# Altium schematic sheet MainAssembly.SchDoc
size 292 x 193 mm; CheckedBy: Jakub Howors; Author: Łukasz Gójski; CompanyName: Politechnika Warszawska; Organization: EITI; Address1: Nowowiejska 15/19; Address2: 00-665 Warszawa; SheetNumber: 1; SheetTotal: 13; HTTPLink: www.pw.edu.pl
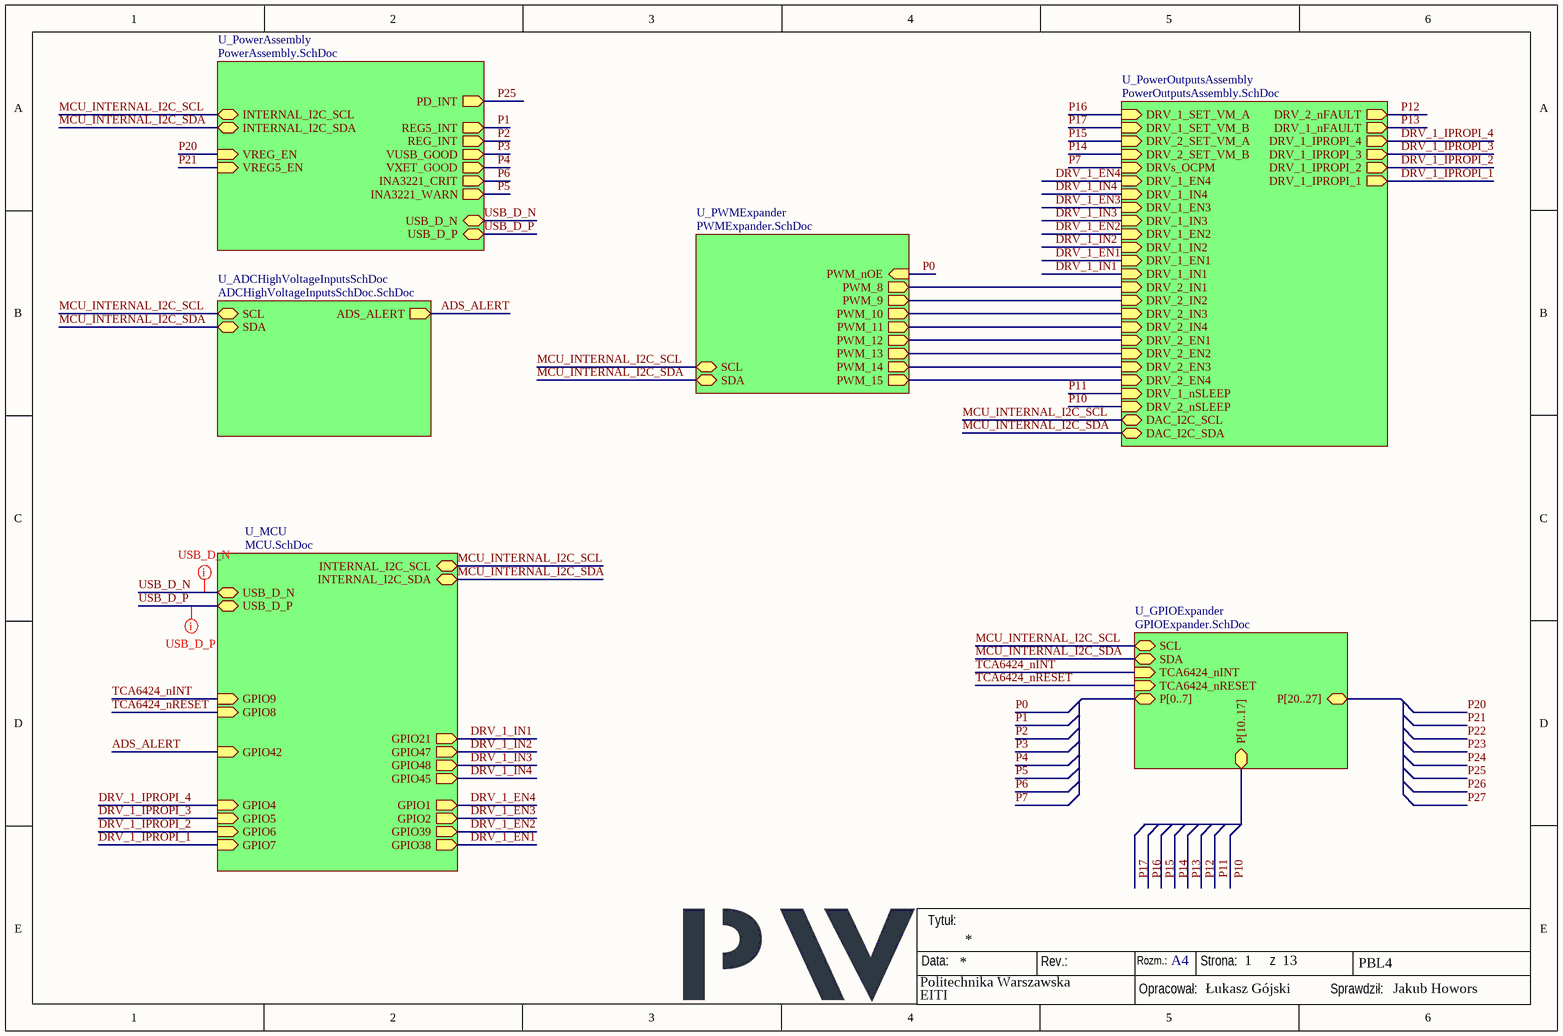
[diagram p0: MainAssembly.SchDoc]

## Sub-sheets
U_ADCHighVoltageInputsSchDoc = ADCHighVoltageInputsSchDoc.SchDoc: ADS_ALERT (out), SCL (bidir), SDA (bidir)
U_GPIOExpander = GPIOExpander.SchDoc: TCA6424_nINT (in), TCA6424_nRESET (in), P[0..7] (bidir), P[10..17] (bidir), P[20..27] (bidir), SCL (bidir), SDA (bidir)
U_MCU = MCU.SchDoc: INTERNAL_I2C_SCL (bidir), INTERNAL_I2C_SDA (bidir), GPIO2 (out), GPIO4 (in), GPIO5 (in), GPIO6 (in), GPIO7 (in), GPIO8 (in), GPIO21 (out), GPIO38 (out), GPIO47 (out), GPIO48 (out), GPIO45 (out), GPIO39 (out), USB_D_N (bidir), USB_D_P (bidir), GPIO1 (out), GPIO42 (in), GPIO9 (in)
U_PowerAssembly = PowerAssembly.SchDoc: REG5_INT (out), REG_INT (out), VUSB_GOOD (out), VXET_GOOD (out), INA3221_CRIT (out), INA3221_WARN (out), INTERNAL_I2C_SDA (bidir), INTERNAL_I2C_SCL (bidir), VREG_EN (in), VREG5_EN (in), USB_D_N (bidir), USB_D_P (bidir), PD_INT (out)
U_PowerOutputsAssembly = PowerOutputsAssembly.SchDoc: DRV_2_nFAULT (out), DRV_1_nFAULT (out), DRV_1_IPROPI_4 (out), DRV_1_IPROPI_3 (out), DRV_1_IPROPI_2 (out), DRV_1_IPROPI_1 (out), DRV_1_SET_VM_A (in), DRV_1_SET_VM_B (in), DRV_2_SET_VM_A (in), DRV_2_SET_VM_B (in), DRVs_OCPM (in), DRV_1_EN4 (in), DRV_1_IN4 (in), DRV_1_EN3 (in), DRV_1_IN3 (in), DRV_1_EN2 (in), DRV_1_IN2 (in), DRV_1_EN1 (in), DRV_1_IN1 (in), DRV_2_EN4 (in), DRV_2_IN4 (in), DRV_2_EN3 (in), DRV_2_IN3 (in), DRV_2_EN2 (in), DRV_2_IN2 (in), DRV_2_EN1 (in), DRV_2_IN1 (in), DRV_1_nSLEEP (in), DRV_2_nSLEEP (in), DAC_I2C_SCL (bidir), DAC_I2C_SDA (bidir)
U_PWMExpander = PWMExpander.SchDoc: SDA (bidir), SCL (bidir), PWM_nOE (in), PWM_8 (out), PWM_9 (out), PWM_10 (out), PWM_11 (out), PWM_12 (out), PWM_13 (out), PWM_14 (out), PWM_15 (out)

## Nets
ADS_ALERT: sheet U_MCU/GPIO42, sheet U_ADCHighVoltageInputsSchDoc/ADS_ALERT
DRV_1_EN1: sheet U_PowerOutputsAssembly/DRV_1_EN1, sheet U_MCU/GPIO38
DRV_1_EN2: sheet U_PowerOutputsAssembly/DRV_1_EN2, sheet U_MCU/GPIO39
DRV_1_EN3: sheet U_PowerOutputsAssembly/DRV_1_EN3, sheet U_MCU/GPIO2
DRV_1_EN4: sheet U_PowerOutputsAssembly/DRV_1_EN4, sheet U_MCU/GPIO1
DRV_1_IN1: sheet U_PowerOutputsAssembly/DRV_1_IN1, sheet U_MCU/GPIO21
DRV_1_IN2: sheet U_PowerOutputsAssembly/DRV_1_IN2, sheet U_MCU/GPIO47
DRV_1_IN3: sheet U_PowerOutputsAssembly/DRV_1_IN3, sheet U_MCU/GPIO48
DRV_1_IN4: sheet U_PowerOutputsAssembly/DRV_1_IN4, sheet U_MCU/GPIO45
DRV_1_IPROPI_1: sheet U_PowerOutputsAssembly/DRV_1_IPROPI_1, sheet U_MCU/GPIO7
DRV_1_IPROPI_2: sheet U_PowerOutputsAssembly/DRV_1_IPROPI_2, sheet U_MCU/GPIO6
DRV_1_IPROPI_3: sheet U_PowerOutputsAssembly/DRV_1_IPROPI_3, sheet U_MCU/GPIO5
DRV_1_IPROPI_4: sheet U_PowerOutputsAssembly/DRV_1_IPROPI_4, sheet U_MCU/GPIO4
MCU_INTERNAL_I2C_SCL: sheet U_PowerAssembly/INTERNAL_I2C_SCL, sheet U_PowerOutputsAssembly/DAC_I2C_SCL, sheet U_PWMExpander/SCL, sheet U_MCU/INTERNAL_I2C_SCL, sheet U_ADCHighVoltageInputsSchDoc/SCL, sheet U_GPIOExpander/SCL
MCU_INTERNAL_I2C_SDA: sheet U_PowerAssembly/INTERNAL_I2C_SDA, sheet U_PowerOutputsAssembly/DAC_I2C_SDA, sheet U_PWMExpander/SDA, sheet U_MCU/INTERNAL_I2C_SDA, sheet U_ADCHighVoltageInputsSchDoc/SDA, sheet U_GPIOExpander/SDA
P0: sheet U_PWMExpander/PWM_nOE
P1: sheet U_PowerAssembly/REG5_INT
P2: sheet U_PowerAssembly/REG_INT
P3: sheet U_PowerAssembly/VUSB_GOOD
P4: sheet U_PowerAssembly/VXET_GOOD
P5: sheet U_PowerAssembly/INA3221_WARN
P6: sheet U_PowerAssembly/INA3221_CRIT
P7: sheet U_PowerOutputsAssembly/DRVs_OCPM
P10: sheet U_PowerOutputsAssembly/DRV_2_nSLEEP
P11: sheet U_PowerOutputsAssembly/DRV_1_nSLEEP
P12: sheet U_PowerOutputsAssembly/DRV_2_nFAULT
P13: sheet U_PowerOutputsAssembly/DRV_1_nFAULT
P14: sheet U_PowerOutputsAssembly/DRV_2_SET_VM_B
P15: sheet U_PowerOutputsAssembly/DRV_2_SET_VM_A
P16: sheet U_PowerOutputsAssembly/DRV_1_SET_VM_A
P17: sheet U_PowerOutputsAssembly/DRV_1_SET_VM_B
P20: sheet U_PowerAssembly/VREG_EN
P21: sheet U_PowerAssembly/VREG5_EN
P25: sheet U_PowerAssembly/PD_INT
TCA6424_nINT: sheet U_MCU/GPIO9, sheet U_GPIOExpander/TCA6424_nINT
TCA6424_nRESET: sheet U_MCU/GPIO8, sheet U_GPIOExpander/TCA6424_nRESET
USB_D_N: sheet U_PowerAssembly/USB_D_N, sheet U_MCU/USB_D_N
USB_D_P: sheet U_PowerAssembly/USB_D_P, sheet U_MCU/USB_D_P
(unnamed): sheet U_PowerOutputsAssembly/DRV_2_EN4, sheet U_PWMExpander/PWM_15
(unnamed): sheet U_PowerOutputsAssembly/DRV_2_IN4, sheet U_PWMExpander/PWM_11
(unnamed): sheet U_PowerOutputsAssembly/DRV_2_EN3, sheet U_PWMExpander/PWM_14
(unnamed): sheet U_PowerOutputsAssembly/DRV_2_IN3, sheet U_PWMExpander/PWM_10
(unnamed): sheet U_PowerOutputsAssembly/DRV_2_EN2, sheet U_PWMExpander/PWM_13
(unnamed): sheet U_PowerOutputsAssembly/DRV_2_IN2, sheet U_PWMExpander/PWM_9
(unnamed): sheet U_PowerOutputsAssembly/DRV_2_EN1, sheet U_PWMExpander/PWM_12
(unnamed): sheet U_PowerOutputsAssembly/DRV_2_IN1, sheet U_PWMExpander/PWM_8

## Layout directives
differential pair: USB_D_N, USB_D_P

## Notes on the sheet
- Data:
- Tytuł:
- Rev.:
- Rozm.:
- A4
- Strona:
- z
- PBL4
- Opracował:
- Sprawdził: